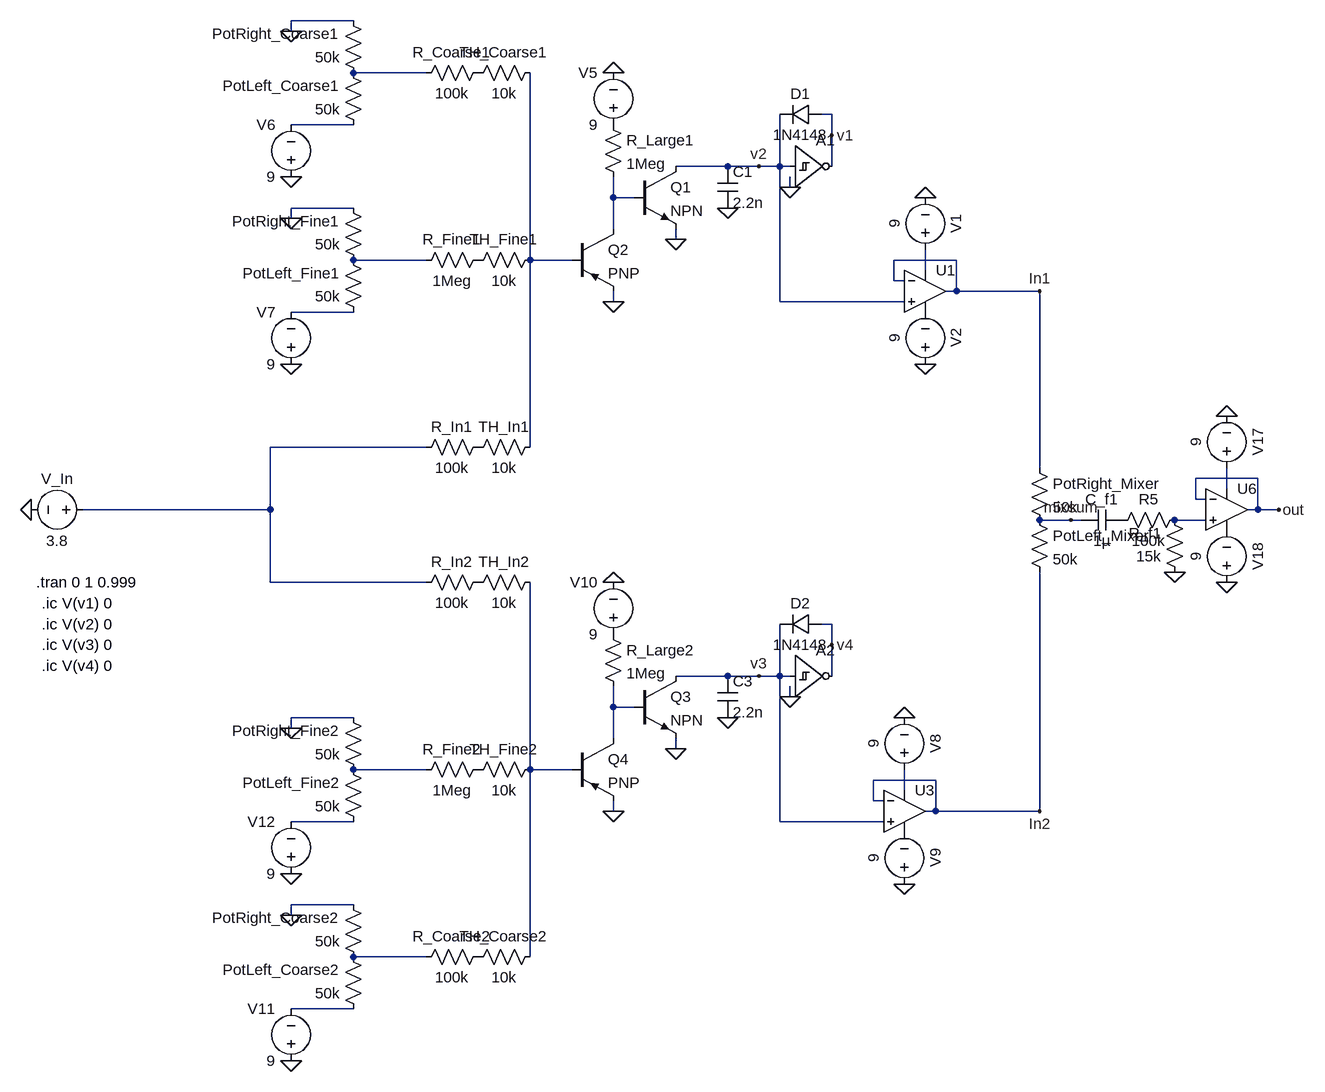
[diagram p0: schematic SPICE simulation.asc]
SPICE simulation.asc, the LTspice schematic file:
Version 4.1
SHEET 1 1464 1484
WIRE -544 -128 -640 -128
WIRE -640 -112 -640 -128
WIRE -432 -48 -544 -48
WIRE 192 16 176 16
WIRE -544 32 -640 32
WIRE 192 48 192 16
WIRE 32 96 -48 96
WIRE 80 96 32 96
WIRE 112 96 112 16
WIRE 112 96 80 96
WIRE 128 96 112 96
WIRE 192 96 192 48
WIRE 128 128 128 112
WIRE -144 144 -144 112
WIRE -112 144 -144 144
WIRE -544 160 -640 160
WIRE -640 176 -640 160
WIRE -144 192 -144 144
WIRE -48 208 -48 192
WIRE -432 240 -544 240
WIRE -272 240 -272 -48
WIRE -208 240 -272 240
WIRE 384 240 288 240
WIRE 336 256 336 224
WIRE 288 272 288 240
WIRE 304 272 288 272
WIRE 384 288 384 240
WIRE 384 288 368 288
WIRE 512 288 384 288
WIRE -144 304 -144 288
WIRE 112 304 112 96
WIRE 304 304 112 304
WIRE -544 320 -640 320
WIRE -432 528 -672 528
WIRE -272 528 -272 240
WIRE 512 560 512 288
WIRE 848 576 752 576
WIRE 800 592 800 560
WIRE 752 608 752 576
WIRE 768 608 752 608
WIRE -672 624 -672 528
WIRE -672 624 -960 624
WIRE 848 624 848 576
WIRE 848 624 832 624
WIRE 880 624 848 624
WIRE 560 640 512 640
WIRE 576 640 560 640
WIRE 768 640 720 640
WIRE -672 736 -672 624
WIRE -432 736 -672 736
WIRE 192 800 176 800
WIRE 192 832 192 800
WIRE 32 880 -48 880
WIRE 80 880 32 880
WIRE 112 880 112 800
WIRE 112 880 80 880
WIRE 128 880 112 880
WIRE 192 880 192 832
WIRE 128 912 128 896
WIRE -144 928 -144 896
WIRE -112 928 -144 928
WIRE -544 944 -640 944
WIRE -640 960 -640 944
WIRE -144 976 -144 928
WIRE -48 992 -48 976
WIRE -432 1024 -544 1024
WIRE -272 1024 -272 736
WIRE -208 1024 -272 1024
WIRE 352 1040 256 1040
WIRE 304 1056 304 1024
WIRE 256 1072 256 1040
WIRE 272 1072 256 1072
WIRE -144 1088 -144 1072
WIRE 352 1088 352 1040
WIRE 352 1088 336 1088
WIRE 512 1088 512 720
WIRE 512 1088 352 1088
WIRE -544 1104 -640 1104
WIRE 112 1104 112 880
WIRE 272 1104 112 1104
WIRE -544 1232 -640 1232
WIRE -640 1248 -640 1232
WIRE -432 1312 -544 1312
WIRE -272 1312 -272 1024
WIRE -544 1392 -640 1392
FLAG -48 208 0
FLAG 192 48 v1
FLAG 80 96 v2
FLAG 880 624 out
FLAG 128 128 0
FLAG 32 160 0
FLAG -144 -48 0
FLAG -144 304 0
FLAG -640 112 0
FLAG -640 -112 0
FLAG -640 176 0
FLAG -640 400 0
FLAG -48 992 0
FLAG 192 832 v4
FLAG 80 880 v3
FLAG 128 912 0
FLAG 32 944 0
FLAG -144 736 0
FLAG -144 1088 0
FLAG -640 1472 0
FLAG -640 1248 0
FLAG -640 960 0
FLAG -640 1184 0
FLAG -1040 624 0
FLAG 512 288 In1
FLAG 512 1088 In2
FLAG 560 640 mixsum
FLAG 336 400 0
FLAG 336 144 0
FLAG 304 1200 0
FLAG 304 944 0
FLAG 720 720 0
FLAG 800 736 0
FLAG 800 480 0
SYMBOL Digital\\schmtinv 128 32 R0
WINDOW 3 8 44 Invisible 2
SYMATTR Value Vhigh=9 Vt=4.45 Vh=.85 Trise=.1u Tfall=.1u
SYMATTR InstName A1
SYMBOL cap 16 96 R0
SYMATTR InstName C1
SYMATTR Value 2.2n
SYMBOL diode 176 0 R90
WINDOW 0 0 32 VBottom 2
WINDOW 3 32 32 VTop 2
SYMATTR InstName D1
SYMATTR Value 1N4148
SYMBOL npn -112 96 R0
SYMATTR InstName Q1
SYMBOL res -160 16 R0
SYMATTR InstName R_Large1
SYMATTR Value 1Meg
SYMBOL voltage -144 48 R180
WINDOW 0 24 96 Left 2
WINDOW 3 24 16 Left 2
WINDOW 123 0 0 Left 0
WINDOW 39 0 0 Left 0
SYMATTR InstName V5
SYMATTR Value 9
SYMBOL pnp -208 192 R0
SYMATTR InstName Q2
SYMBOL res -256 224 R90
WINDOW 0 0 56 VBottom 2
WINDOW 3 32 56 VTop 2
SYMATTR InstName TH_Fine1
SYMATTR Value 10k
SYMBOL res -256 -64 R90
WINDOW 0 0 56 VBottom 2
WINDOW 3 32 56 VTop 2
SYMATTR InstName TH_Coarse1
SYMATTR Value 10k
SYMBOL res -336 -64 R90
WINDOW 0 0 56 VBottom 2
WINDOW 3 32 56 VTop 2
SYMATTR InstName R_Coarse1
SYMATTR Value 100k
SYMBOL res -336 224 R90
WINDOW 0 0 56 VBottom 2
WINDOW 3 32 56 VTop 2
SYMATTR InstName R_Fine1
SYMATTR Value 1Meg
SYMBOL res -528 -32 R180
WINDOW 0 36 76 Left 2
WINDOW 3 36 40 Left 2
SYMATTR InstName PotRight_Coarse1
SYMATTR Value 50k
SYMBOL res -528 48 R180
WINDOW 0 36 76 Left 2
WINDOW 3 36 40 Left 2
SYMATTR InstName PotLeft_Coarse1
SYMATTR Value 50k
SYMBOL voltage -640 128 R180
WINDOW 0 24 96 Left 2
WINDOW 3 24 16 Left 2
WINDOW 123 0 0 Left 0
WINDOW 39 0 0 Left 0
SYMATTR InstName V6
SYMATTR Value 9
SYMBOL res -528 256 R180
WINDOW 0 36 76 Left 2
WINDOW 3 36 40 Left 2
SYMATTR InstName PotRight_Fine1
SYMATTR Value 50k
SYMBOL res -528 336 R180
WINDOW 0 36 76 Left 2
WINDOW 3 36 40 Left 2
SYMATTR InstName PotLeft_Fine1
SYMATTR Value 50k
SYMBOL voltage -640 416 R180
WINDOW 0 24 96 Left 2
WINDOW 3 24 16 Left 2
WINDOW 123 0 0 Left 0
WINDOW 39 0 0 Left 0
SYMATTR InstName V7
SYMATTR Value 9
SYMBOL res -256 512 R90
WINDOW 0 0 56 VBottom 2
WINDOW 3 32 56 VTop 2
SYMATTR InstName TH_In1
SYMATTR Value 10k
SYMBOL res -336 512 R90
WINDOW 0 0 56 VBottom 2
WINDOW 3 32 56 VTop 2
SYMATTR InstName R_In1
SYMATTR Value 100k
SYMBOL Digital\\schmtinv 128 816 R0
WINDOW 3 8 44 Invisible 2
SYMATTR Value Vhigh=9 Vt=4.45 Vh=.85 Trise=.1u Tfall=.1u
SYMATTR InstName A2
SYMBOL cap 16 880 R0
SYMATTR InstName C3
SYMATTR Value 2.2n
SYMBOL diode 176 784 R90
WINDOW 0 0 32 VBottom 2
WINDOW 3 32 32 VTop 2
SYMATTR InstName D2
SYMATTR Value 1N4148
SYMBOL npn -112 880 R0
SYMATTR InstName Q3
SYMBOL res -160 800 R0
SYMATTR InstName R_Large2
SYMATTR Value 1Meg
SYMBOL voltage -144 832 R180
WINDOW 0 24 96 Left 2
WINDOW 3 24 16 Left 2
WINDOW 123 0 0 Left 0
WINDOW 39 0 0 Left 0
SYMATTR InstName V10
SYMATTR Value 9
SYMBOL pnp -208 976 R0
SYMATTR InstName Q4
SYMBOL res -256 1008 R90
WINDOW 0 0 56 VBottom 2
WINDOW 3 32 56 VTop 2
SYMATTR InstName TH_Fine2
SYMATTR Value 10k
SYMBOL res -256 1296 R90
WINDOW 0 0 56 VBottom 2
WINDOW 3 32 56 VTop 2
SYMATTR InstName TH_Coarse2
SYMATTR Value 10k
SYMBOL res -336 1296 R90
WINDOW 0 0 56 VBottom 2
WINDOW 3 32 56 VTop 2
SYMATTR InstName R_Coarse2
SYMATTR Value 100k
SYMBOL res -336 1008 R90
WINDOW 0 0 56 VBottom 2
WINDOW 3 32 56 VTop 2
SYMATTR InstName R_Fine2
SYMATTR Value 1Meg
SYMBOL res -528 1328 R180
WINDOW 0 36 76 Left 2
WINDOW 3 36 40 Left 2
SYMATTR InstName PotRight_Coarse2
SYMATTR Value 50k
SYMBOL res -528 1408 R180
WINDOW 0 36 76 Left 2
WINDOW 3 36 40 Left 2
SYMATTR InstName PotLeft_Coarse2
SYMATTR Value 50k
SYMBOL voltage -640 1488 R180
WINDOW 0 24 96 Left 2
WINDOW 3 24 16 Left 2
WINDOW 123 0 0 Left 0
WINDOW 39 0 0 Left 0
SYMATTR InstName V11
SYMATTR Value 9
SYMBOL res -528 1040 R180
WINDOW 0 36 76 Left 2
WINDOW 3 36 40 Left 2
SYMATTR InstName PotRight_Fine2
SYMATTR Value 50k
SYMBOL res -528 1120 R180
WINDOW 0 36 76 Left 2
WINDOW 3 36 40 Left 2
SYMATTR InstName PotLeft_Fine2
SYMATTR Value 50k
SYMBOL voltage -640 1200 R180
WINDOW 0 24 96 Left 2
WINDOW 3 24 16 Left 2
WINDOW 123 0 0 Left 0
WINDOW 39 0 0 Left 0
SYMATTR InstName V12
SYMATTR Value 9
SYMBOL res -256 720 R90
WINDOW 0 0 56 VBottom 2
WINDOW 3 32 56 VTop 2
SYMATTR InstName TH_In2
SYMATTR Value 10k
SYMBOL res -336 720 R90
WINDOW 0 0 56 VBottom 2
WINDOW 3 32 56 VTop 2
SYMATTR InstName R_In2
SYMATTR Value 100k
SYMBOL voltage -944 624 R90
WINDOW 0 -32 56 VBottom 2
WINDOW 3 32 56 VTop 2
WINDOW 123 0 0 Left 0
WINDOW 39 0 0 Left 0
SYMATTR InstName V_In
SYMATTR Value 3.8
SYMBOL res 496 544 R0
SYMATTR InstName PotRight_Mixer
SYMATTR Value 50k
SYMBOL res 496 624 R0
SYMATTR InstName PotLeft_Mixer
SYMATTR Value 50k
SYMBOL OpAmps\\UniversalOpAmp2 336 288 R0
SYMATTR InstName U1
SYMBOL voltage 336 240 R180
WINDOW 0 -32 56 VBottom 2
WINDOW 3 32 56 VTop 2
WINDOW 123 0 0 Left 0
WINDOW 39 0 0 Left 0
SYMATTR InstName V1
SYMATTR Value 9
SYMBOL voltage 336 416 R180
WINDOW 0 -32 56 VBottom 2
WINDOW 3 32 56 VTop 2
WINDOW 123 0 0 Left 0
WINDOW 39 0 0 Left 0
SYMATTR InstName V2
SYMATTR Value 9
SYMBOL OpAmps\\UniversalOpAmp2 304 1088 R0
SYMATTR InstName U3
SYMBOL voltage 304 1040 R180
WINDOW 0 -32 56 VBottom 2
WINDOW 3 32 56 VTop 2
WINDOW 123 0 0 Left 0
WINDOW 39 0 0 Left 0
SYMATTR InstName V8
SYMATTR Value 9
SYMBOL voltage 304 1216 R180
WINDOW 0 -32 56 VBottom 2
WINDOW 3 32 56 VTop 2
WINDOW 123 0 0 Left 0
WINDOW 39 0 0 Left 0
SYMATTR InstName V9
SYMATTR Value 9
SYMBOL cap 640 624 R90
WINDOW 0 0 32 VBottom 2
WINDOW 3 32 32 VTop 2
SYMATTR InstName C_f1
SYMATTR Value 1µ
SYMBOL res 736 736 R180
WINDOW 0 36 76 Left 2
WINDOW 3 36 40 Left 2
SYMATTR InstName R_f1
SYMATTR Value 15k
SYMBOL OpAmps\\UniversalOpAmp2 800 624 R0
SYMATTR InstName U6
SYMBOL voltage 800 576 R180
WINDOW 0 -32 56 VBottom 2
WINDOW 3 32 56 VTop 2
WINDOW 123 0 0 Left 0
WINDOW 39 0 0 Left 0
SYMATTR InstName V17
SYMATTR Value 9
SYMBOL voltage 800 752 R180
WINDOW 0 -32 56 VBottom 2
WINDOW 3 32 56 VTop 2
WINDOW 123 0 0 Left 0
WINDOW 39 0 0 Left 0
SYMATTR InstName V18
SYMATTR Value 9
SYMBOL res 736 624 R90
WINDOW 0 0 56 VBottom 2
WINDOW 3 32 56 VTop 2
SYMATTR InstName R5
SYMATTR Value 100k
TEXT -1032 736 Left 2 !.tran 0 1 0.999
TEXT -1024 768 Left 2 !.ic V(v1) 0
TEXT -1024 800 Left 2 !.ic V(v2) 0
TEXT -1024 832 Left 2 !.ic V(v3) 0
TEXT -1024 864 Left 2 !.ic V(v4) 0

The netlist it stands for:
* SPICE simulation.asc
A1 v2 0 0 0 0 v1 0 0 SCHMITT Vhigh=9 Vt=4.45 Vh=.85 Trise=.1u Tfall=.1u
C1 v2 0 2.2n
D1 v1 v2 1N4148
Q1 v2 N003 0 0 NPN
R_Large1 P001 N003 1Meg
V5 P001 0 9
Q2 N003 N005 0 0 PNP
R§TH_Fine1 N005 P002 10k
R§TH_Coarse1 N005 P003 10k
R_Coarse1 P003 N001 100k
R_Fine1 P002 N004 1Meg
R§PotRight_Coarse1 N001 0 50k
R§PotLeft_Coarse1 N002 N001 50k
V6 0 N002 9
R§PotRight_Fine1 N004 0 50k
R§PotLeft_Fine1 N007 N004 50k
V7 0 N007 9
R§TH_In1 N005 P004 10k
R_In1 P004 N008 100k
A2 v3 0 0 0 0 v4 0 0 SCHMITT Vhigh=9 Vt=4.45 Vh=.85 Trise=.1u Tfall=.1u
C3 v3 0 2.2n
D2 v4 v3 1N4148
Q3 v3 N011 0 0 NPN
R_Large2 P005 N011 1Meg
V10 P005 0 9
Q4 N011 N013 0 0 PNP
R§TH_Fine2 N013 P006 10k
R§TH_Coarse2 N013 P007 10k
R_Coarse2 P007 N016 100k
R_Fine2 P006 N012 1Meg
R§PotRight_Coarse2 N016 0 50k
R§PotLeft_Coarse2 N017 N016 50k
V11 0 N017 9
R§PotRight_Fine2 N012 0 50k
R§PotLeft_Fine2 N015 N012 50k
V12 0 N015 9
R§TH_In2 N013 P008 10k
R_In2 P008 N008 100k
V_In N008 0 3.8
R§PotRight_Mixer In1 mixsum 50k
R§PotLeft_Mixer mixsum In2 50k
X§U1 v2 In1 N006 P009 In1 level2 Avol=1Meg GBW=10Meg Slew=10Meg Ilimit=25m Rail=0 Vos=0 En=0 Enk=0 In=0 Ink=0 Rin=500Meg  ; pins In+ In- V+ V- OUT
V1 N006 0 9
V2 0 P009 9
X§U3 v3 In2 N014 P010 In2 level2 Avol=1Meg GBW=10Meg Slew=10Meg Ilimit=25m Rail=0 Vos=0 En=0 Enk=0 In=0 Ink=0 Rin=500Meg  ; pins In+ In- V+ V- OUT
V8 N014 0 9
V9 0 P010 9
C_f1 P011 mixsum 1µ
R_f1 0 N010 15k
X§U6 N010 out N009 P012 out level2 Avol=1Meg GBW=10Meg Slew=10Meg Ilimit=25m Rail=0 Vos=0 En=0 Enk=0 In=0 Ink=0 Rin=500Meg  ; pins In+ In- V+ V- OUT
V17 N009 0 9
V18 0 P012 9
R5 N010 P011 100k
.model D D
.lib standard.dio
.model NPN NPN
.model PNP PNP
.lib standard.bjt
.tran 0 1 0.999
.ic V(v1) 0
.ic V(v2) 0
.ic V(v3) 0
.ic V(v4) 0
.lib UniversalOpAmp2.lib
.backanno
.end